# Altium schematic sheet Sh_Output.SchDoc
size 199 x 200 mm
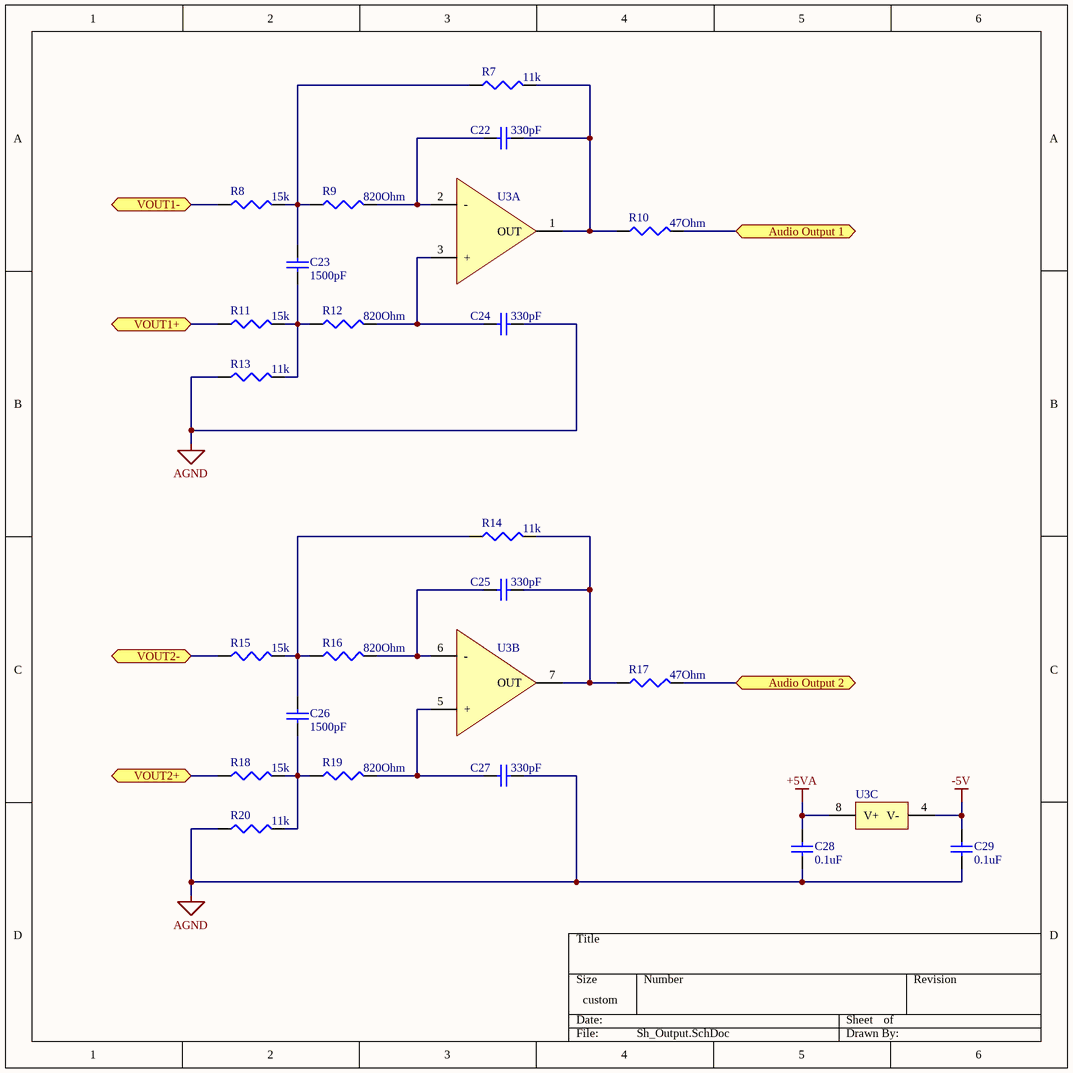
[diagram p0: Sh_Output.SchDoc]

## Parts
C22  value 330pF  [1608[0603]]  (hidden comment: Cap Semi)
C23  value 1500pF  [1608[0603]]  (hidden comment: Cap Semi)
C24  value 330pF  [1608[0603]]  (hidden comment: Cap Semi)
C25  value 330pF  [1608[0603]]  (hidden comment: Cap Semi)
C26  value 1500pF  [1608[0603]]  (hidden comment: Cap Semi)
C27  value 330pF  [1608[0603]]  (hidden comment: Cap Semi)
C28  value 0.1uF  [1608[0603]]  (hidden comment: Cap Semi)
C29  value 0.1uF  [1608[0603]]  (hidden comment: Cap Semi)
R7  value 11k  [J1-0603]  (hidden comment: Res3)
R8  value 15k  [J1-0603]  (hidden comment: Res3)
R9  value 820Ohm  [J1-0603]  (hidden comment: Res3)
R10  value 47Ohm  [J1-0603]  (hidden comment: Res3)
R11  value 15k  [J1-0603]  (hidden comment: Res3)
R12  value 820Ohm  [J1-0603]  (hidden comment: Res3)
R13  value 11k  [J1-0603]  (hidden comment: Res3)
R14  value 11k  [J1-0603]  (hidden comment: Res3)
R15  value 15k  [J1-0603]  (hidden comment: Res3)
R16  value 820Ohm  [J1-0603]  (hidden comment: Res3)
R17  value 47Ohm  [J1-0603]  (hidden comment: Res3)
R18  value 15k  [J1-0603]  (hidden comment: Res3)
R19  value 820Ohm  [J1-0603]  (hidden comment: Res3)
R20  value 11k  [J1-0603]  (hidden comment: Res3)
U3  NE5532A  [SOIC127P600-8AL]  (value not drawn)  (parts A,B,C of 3)

## Ports
Audio Output 1, Audio Output 2, VOUT1+, VOUT1-, VOUT2+, VOUT2-

## Nets
+5VA: C28.1 U3.8(V+)
-5V: C29.1 U3.4(V-)
AGND: C24.1 C27.1 C28.2 C29.2 R13.1 R20.1
Audio Output 1: R10.2 ; port Audio Output 1
Audio Output 2: R17.2 ; port Audio Output 2
VOUT1+: R11.1 ; port VOUT1+
VOUT1-: R8.1 ; port VOUT1-
VOUT2+: R18.1 ; port VOUT2+
VOUT2-: R15.1 ; port VOUT2-
NetC22_1: C22.1 R7.2 R10.1 U3.1(OUT)
NetC22_2: C22.2 R9.2 U3.2(-)
NetC23_1: C23.1 R7.1 R8.2 R9.1
NetC23_2: C23.2 R11.2 R12.1 R13.2
NetC24_2: C24.2 R12.2 U3.3(+)
NetC25_1: C25.1 R14.2 R17.1 U3.7(OUT)
NetC25_2: C25.2 R16.2 U3.6(-)
NetC26_1: C26.1 R14.1 R15.2 R16.1
NetC26_2: C26.2 R18.2 R19.1 R20.2
NetC27_2: C27.2 R19.2 U3.5(+)

## Library data of the parts
C22-C29 = Cap Semi: Capacitor (Semiconductor SIM Model); Published: 8-Jun-2000; LatestRevisionDate: 29-May-2009; LatestRevisionNote: IPC-7351 Footprint Added.; PackageReference: C1206; Publisher: Altium Limited; PackageDescription: Chip Capacitor
R7-R20 = Res3: Resistor; Published: 8-Jun-2000; LatestRevisionDate: 29-May-2009; LatestRevisionNote: IPC-7351 Footprint Added.; PackageReference: J1-0603; Publisher: Altium Limited; PackageDescription: Chip Resistor
U3 = Ampli_op: Amplificateur Opérationnel